# EAGLE design SEMAFORO (EAGLE 7.3.0)
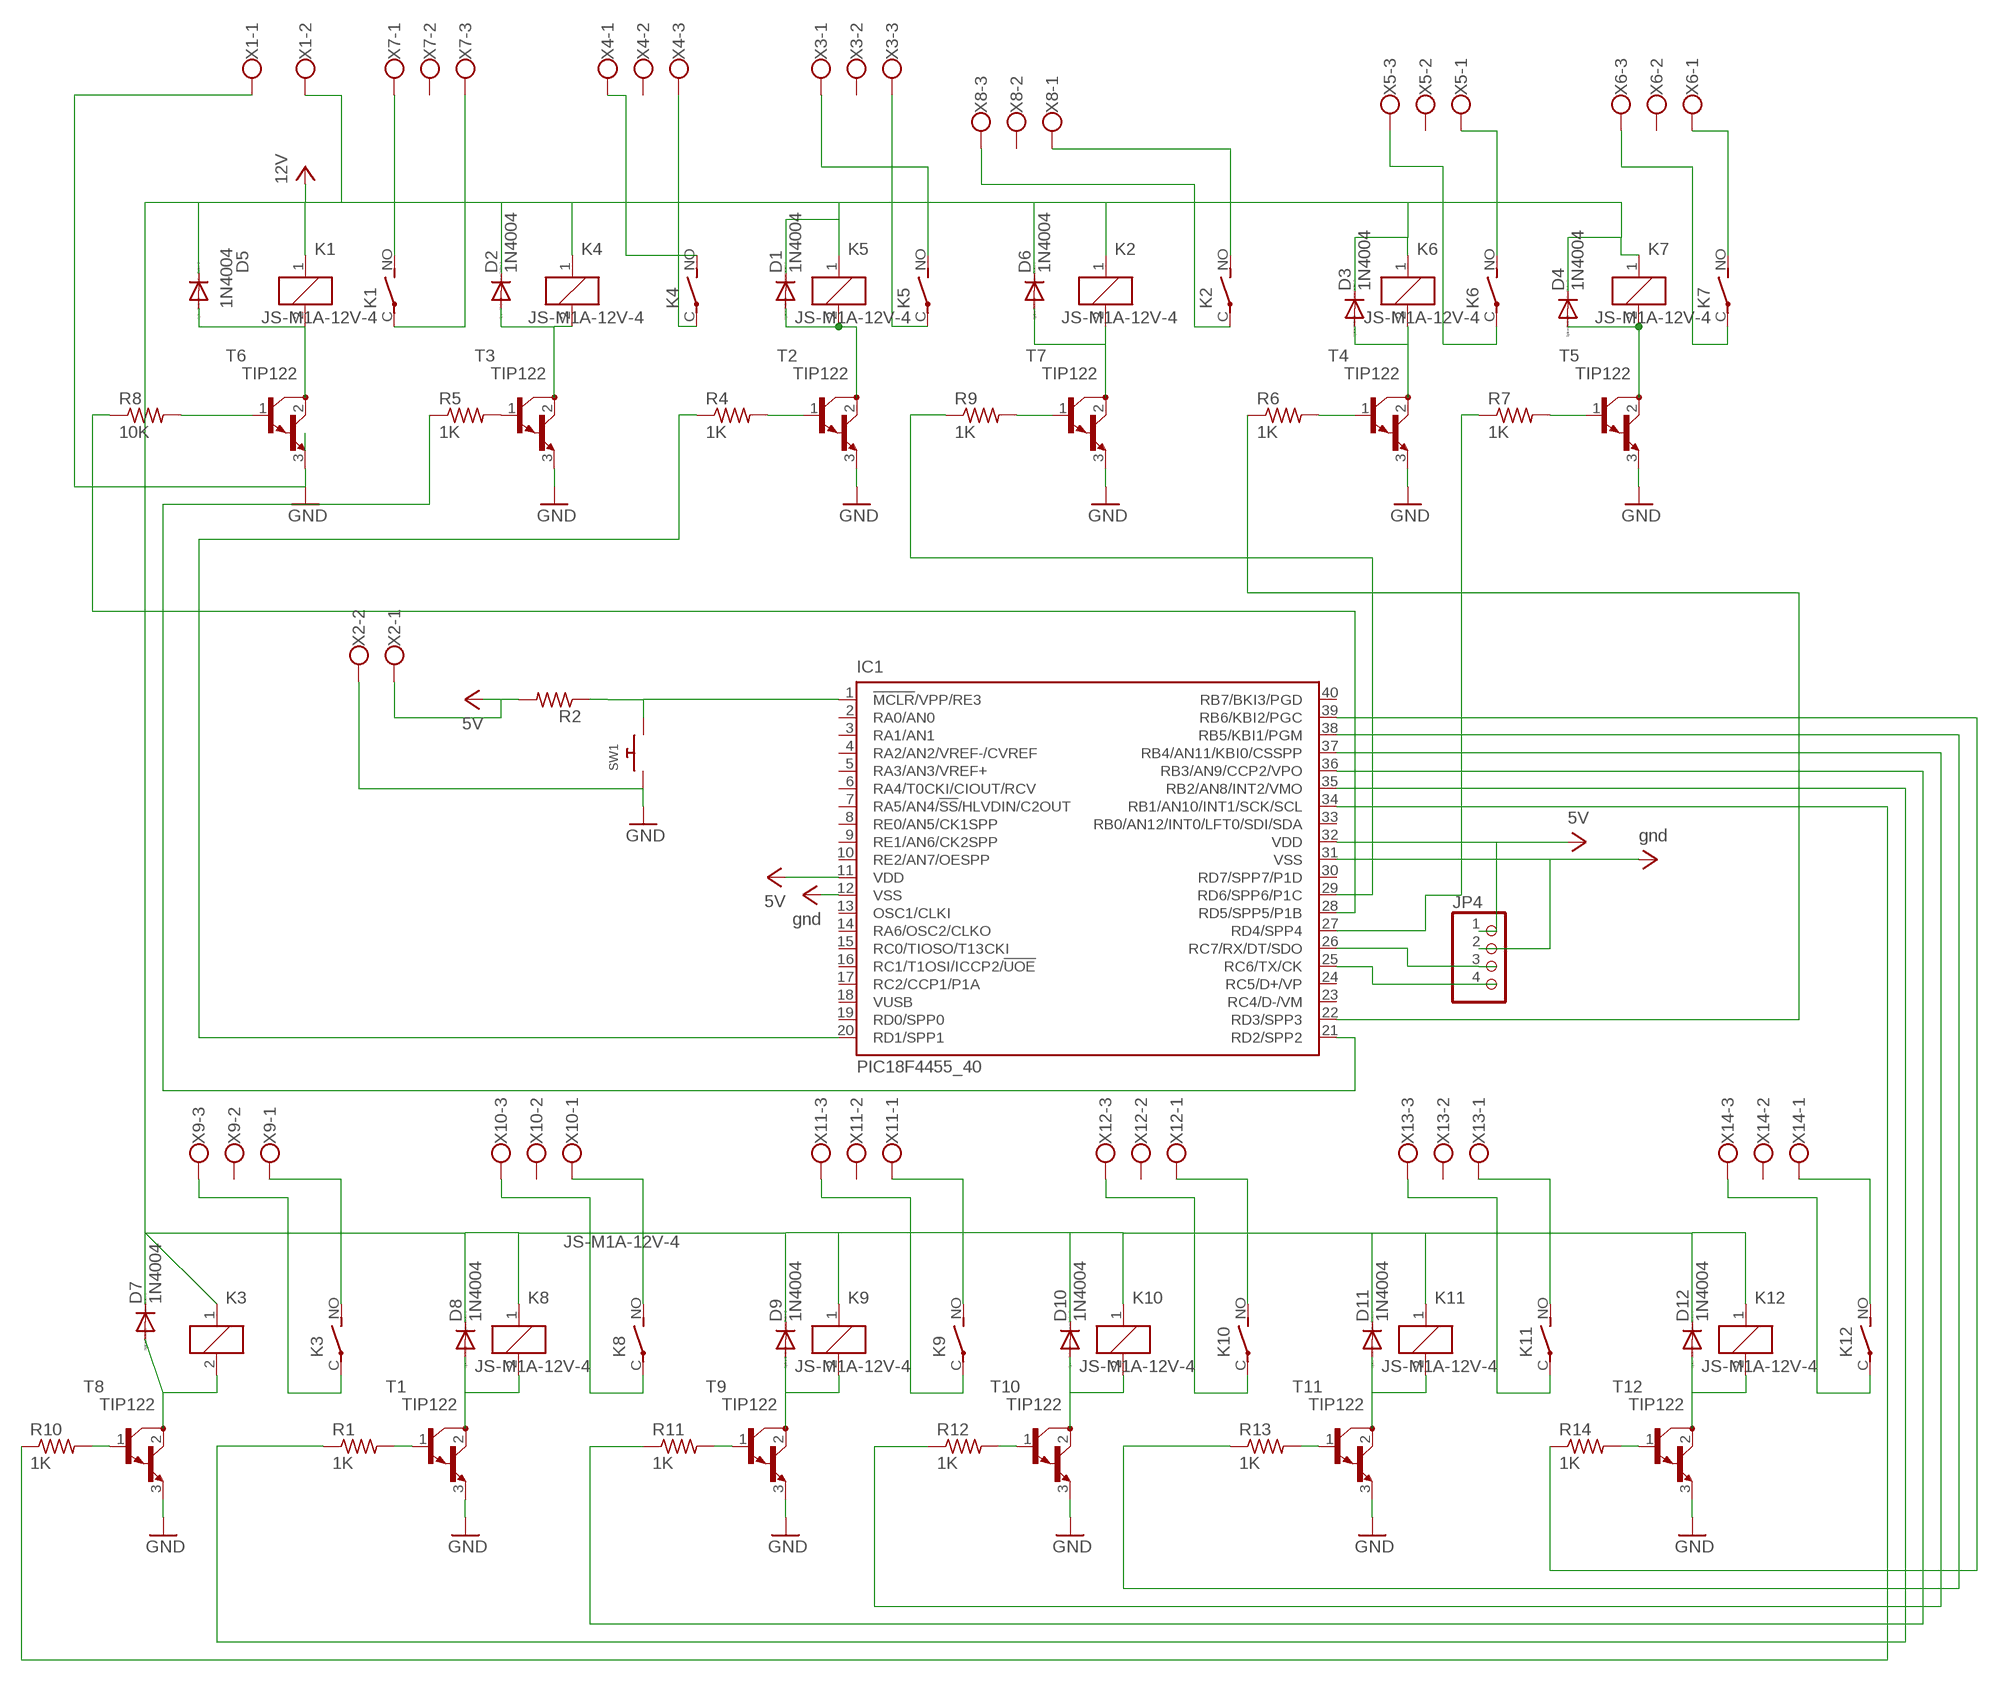
[diagram p0: schematic, sheet 1]

## Parts
D1  1N4004  [DO41-10]
D2  1N4004  [DO41-10]
D3  1N4004  [DO41-10]
D4  1N4004  [DO41-10]
D5  1N4004  [DO41-10]
D6  1N4004  [DO41-10]
D7  1N4004  [DO41-10]
D8  1N4004  [DO41-10]
D9  1N4004  [DO41-10]
D10  1N4004  [DO41-10]
D11  1N4004  [DO41-10]
D12  1N4004  [DO41-10]
IC1  PIC18F4455_40  [DIL40]
JP4  PINHD-1X4  [1X04]
K1  JS-M1A-12V-4  [JS-M1A]
K2  JS-M1A-12V-4  [JS-M1A]
K3  JS-M1A-12V-4  [JS-M1A]
K4  JS-M1A-12V-4  [JS-M1A]
K5  JS-M1A-12V-4  [JS-M1A]
K6  JS-M1A-12V-4  [JS-M1A]
K7  JS-M1A-12V-4  [JS-M1A]
K8  JS-M1A-12V-4  [JS-M1A]
K9  JS-M1A-12V-4  [JS-M1A]
K10  JS-M1A-12V-4  [JS-M1A]
K11  JS-M1A-12V-4  [JS-M1A]
K12  JS-M1A-12V-4  [JS-M1A]
R1  1K  R-US_0207/10  [0207/10]
R2  R-US_0207/10  [0207/10]
R4  1K  R-US_0207/10  [0207/10]
R5  1K  R-US_0207/10  [0207/10]
R6  1K  R-US_0207/10  [0207/10]
R7  1K  R-US_0207/10  [0207/10]
R8  10K  R-US_0207/10  [0207/10]
R9  1K  R-US_0207/10  [0207/10]
R10  1K  R-US_0207/10  [0207/10]
R11  1K  R-US_0207/10  [0207/10]
R12  1K  R-US_0207/10  [0207/10]
R13  1K  R-US_0207/10  [0207/10]
R14  1K  R-US_0207/10  [0207/10]
SW1  SWITCH_PUSHBUTTONEVQ-PE  [TACT_PANA-EVQ]
T1  TIP122  [TO220]
T2  TIP122  [TO220]
T3  TIP122  [TO220]
T4  TIP122  [TO220]
T5  TIP122  [TO220]
T6  TIP122  [TO220]
T7  TIP122  [TO220]
T8  TIP122  [TO220]
T9  TIP122  [TO220]
T10  TIP122  [TO220]
T11  TIP122  [TO220]
T12  TIP122  [TO220]
X1  W237-102  [W237-102]
X2  W237-102  [W237-102]
X3  W237-103  [W237-103]
X4  W237-103  [W237-103]
X5  W237-103  [W237-103]
X6  W237-103  [W237-103]
X7  W237-103  [W237-103]
X8  W237-103  [W237-103]
X9  W237-103  [W237-103]
X10  W237-103  [W237-103]
X11  W237-103  [W237-103]
X12  W237-103  [W237-103]
X13  W237-103  [W237-103]
X14  W237-103  [W237-103]

## Nets
GND: IC1.12(VSS) IC1.31(VSS) JP4.2 SW1.P$1 T1.3(E) T2.3(E) T3.3(E) T4.3(E) T5.3(E) T6.3(E) T7.3(E) T8.3(E) T9.3(E) T10.3(E) T11.3(E) T12.3(E) X1.1 X2.2 ; supply symbol labelled gnd
N$1: D8.A K8.2 T1.2(C)
N$3: IC1.1(!MCLR!/VPP/RE3) R2.1 SW1.P$2
N$4: R8.2 T6.1(B)
N$5: D5.A K1.2 T6.2(C)
N$6: K4.NO(2:S) X4.1
N$7: K1.NO(2:S) X7.1
N$8: R5.2 T3.1(B)
N$9: R1.2 T1.1(B)
N$10: IC1.21(RD2/SPP2) R5.1
N$11: K8.C(2:P) X10.3
N$12: R4.2 T2.1(B)
N$13: D1.A K5.2 T2.2(C)
N$14: K1.C(2:P) X7.3
N$15: K8.NO(2:S) X10.1
N$17: K6.NO(2:S) X5.1
N$22: D2.A K4.2 T3.2(C)
N$25: R9.2 T7.1(B)
N$26: D9.A K9.2 T9.2(C)
N$28: R6.2 T4.1(B)
N$30: R11.2 T9.1(B)
N$45: R7.2 T5.1(B)
N$53: IC1.35(RB2/AN8/INT2/VMO) R1.1
N$60: IC1.20(RD1/SPP1) R4.1
N$61: D6.A K2.2 T7.2(C)
N$62: K2.NO(2:S) X8.1
N$73: K9.C(2:P) X11.3
N$74: K2.C(2:P) X8.3
N$75: D3.A K6.2 T4.2(C)
N$76: K9.NO(2:S) X11.1
N$77: D4.A K7.2 T5.2(C)
N$78: D7.A K3.2 T8.2(C)
N$79: R10.2 T8.1(B)
N$81: IC1.36(RB3/AN9/CCP2/VPO) R11.1
N$82: K3.C(2:P) X9.3
N$83: K3.NO(2:S) X9.1
N$98: IC1.37(RB4/AN11/KBI0/CSSPP) R12.1
N$127: IC1.25(RC6/TX/CK) JP4.4
N$128: IC1.26(RC7/RX/DT/SDO) JP4.3
N$129: D10.A K10.2 T10.2(C)
N$130: K4.C(2:P) X4.3
N$131: K5.NO(2:S) X3.1
N$132: K5.C(2:P) X3.3
N$133: K6.C(2:P) X5.3
N$135: K7.NO(2:S) X6.1
N$136: K7.C(2:P) X6.3
N$137: R12.2 T10.1(B)
N$138: K10.C(2:P) X12.3
N$139: K10.NO(2:S) X12.1
N$140: D11.A K11.2 T11.2(C)
N$141: R13.2 T11.1(B)
N$142: K11.C(2:P) X13.3
N$143: K11.NO(2:S) X13.1
N$144: D12.A K12.2 T12.2(C)
N$145: R14.2 T12.1(B)
N$146: K12.C(2:P) X14.3
N$147: K12.NO(2:S) X14.1
N$148: IC1.27(RD4/SPP4) R7.1
N$149: IC1.22(RD3/SPP3) R6.1
N$150: IC1.28(RD5/SPP5/P1B) R8.1
N$151: IC1.29(RD6/SPP6/P1C) R9.1
N$152: IC1.38(RB5/KBI1/PGM) R13.1
N$153: IC1.34(RB1/AN10/INT1/SCK/SCL) R10.1
N$154: IC1.39(RB6/KBI2/PGC) R14.1
VCC: IC1.11(VDD) IC1.32(VDD) JP4.1 R2.2 X2.1 ; supply symbol labelled 5V
VCC12: D1.C D2.C D3.C D4.C D5.C D6.C D7.C D8.C D9.C D10.C D11.C D12.C K1.1 K2.1 K3.1 K4.1 K5.1 K6.1 K7.1 K8.1 K9.1 K10.1 K11.1 K12.1 X1.2 ; supply symbol labelled 12V
Unconnected: IC1.2(RA0/AN0) IC1.3(RA1/AN1) IC1.4(RA2/AN2/VREF-/CVREF) IC1.5(RA3/AN3/VREF+) IC1.6(RA4/T0CKI/CIOUT/RCV) IC1.7(RA5/AN4/!SS!/HLVDIN/C2OUT) IC1.8(RE0/AN5/CK1SPP) IC1.9(RE1/AN6/CK2SPP) IC1.10(RE2/AN7/OESPP) IC1.13(OSC1/CLKI) IC1.14(RA6/OSC2/CLKO) IC1.15(RC0/TIOSO/T13CKI) IC1.16(RC1/T1OSI/ICCP2/!UOE) IC1.17(RC2/CCP1/P1A) IC1.18(VUSB) IC1.19(RD0/SPP0) IC1.23(RC4/D-/VM) IC1.24(RC5/D+/VP) IC1.30(RD7/SPP7/P1D) IC1.33(RB0/AN12/INT0/LFT0/SDI/SDA) IC1.40(RB7/BKI3/PGD) X3.2 X4.2 X5.2 X6.2 X7.2 X8.2 X9.2 X10.2 X11.2 X12.2 X13.2 X14.2

## Library data of the parts
D1-D12 = diode:1N4004: DIODE general purpose rectifier, 1 A
IC1 = microchip:PIC18F4*_40: USB Microcontrollers with nanoWatt Technology High-Performance, Enhanced Flash, 28/40/44-Pin, Source: http://ww1.microchip.com/downloads/en/devicedoc/39632c.pdf; MF: MICROCHIP; MPN: PIC18F4455-I/P; OC_FARNELL: 9321314; OC_NEWARK: 05K2028
JP4 = pinhead:PINHD-1X4: PIN HEADER
K1-K12 = relay:JS-M1A*: Automotive Ultra-Miniature Power Relay NAiS Source: http://www.mew-europe.com/.. en_ds_61211_0000.pdf; MPN: JSM1A-12V-4; OC_FARNELL: unknown; OC_NEWARK: 13P4554
R1 R2 R4-R14 = adafruit:R-US_: RESISTOR, American symbol
SW1 = adafruit:SWITCH_PUSHBUTTON: Buttons SOFTTOUCHSMD_SJ - Soft touch temporary push button (Super Junk Akihabara) Compatible with SKPMANE010 [Mouser: 688-SKPMAN] C&K_KSS = Digikey: KSS221GLFS
T1-T12 = transistor:TIP122: NPN BIPOLAR DARLINGTON TRANSISTOR
X1 X2 = con-wago-500:W237-102: WAGO SCREW CLAMP; MPN: 237-102; OC_FARNELL: unknown; OC_NEWARK: 70K9898
X3-X14 = con-wago-500:W237-103: WAGO SCREW CLAMP; MPN: 237-103; OC_FARNELL: unknown; OC_NEWARK: 18M7116

## Board
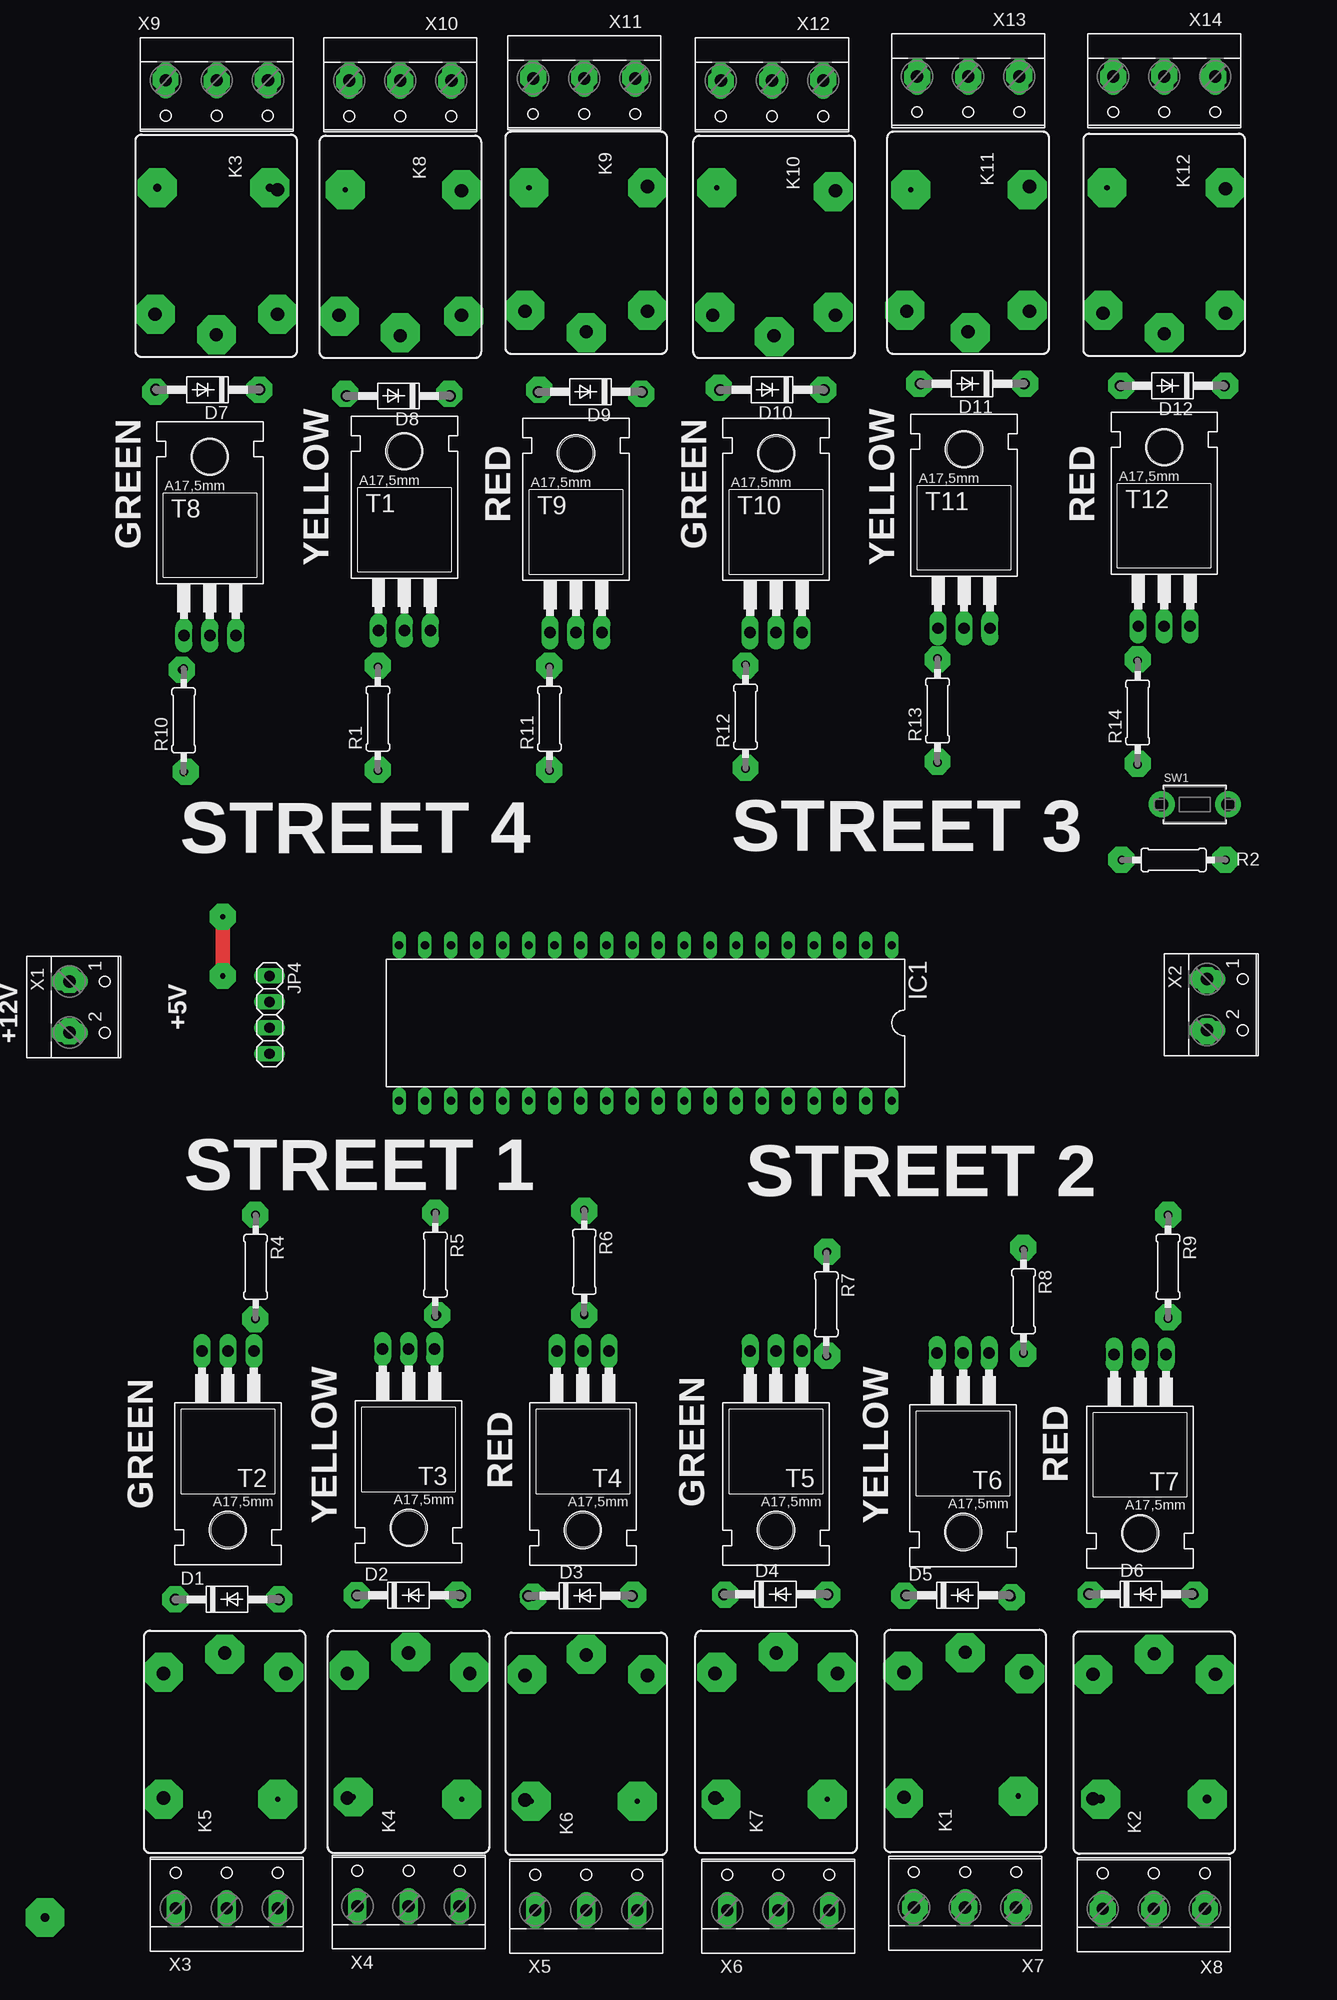
[diagram p1: board, top side]
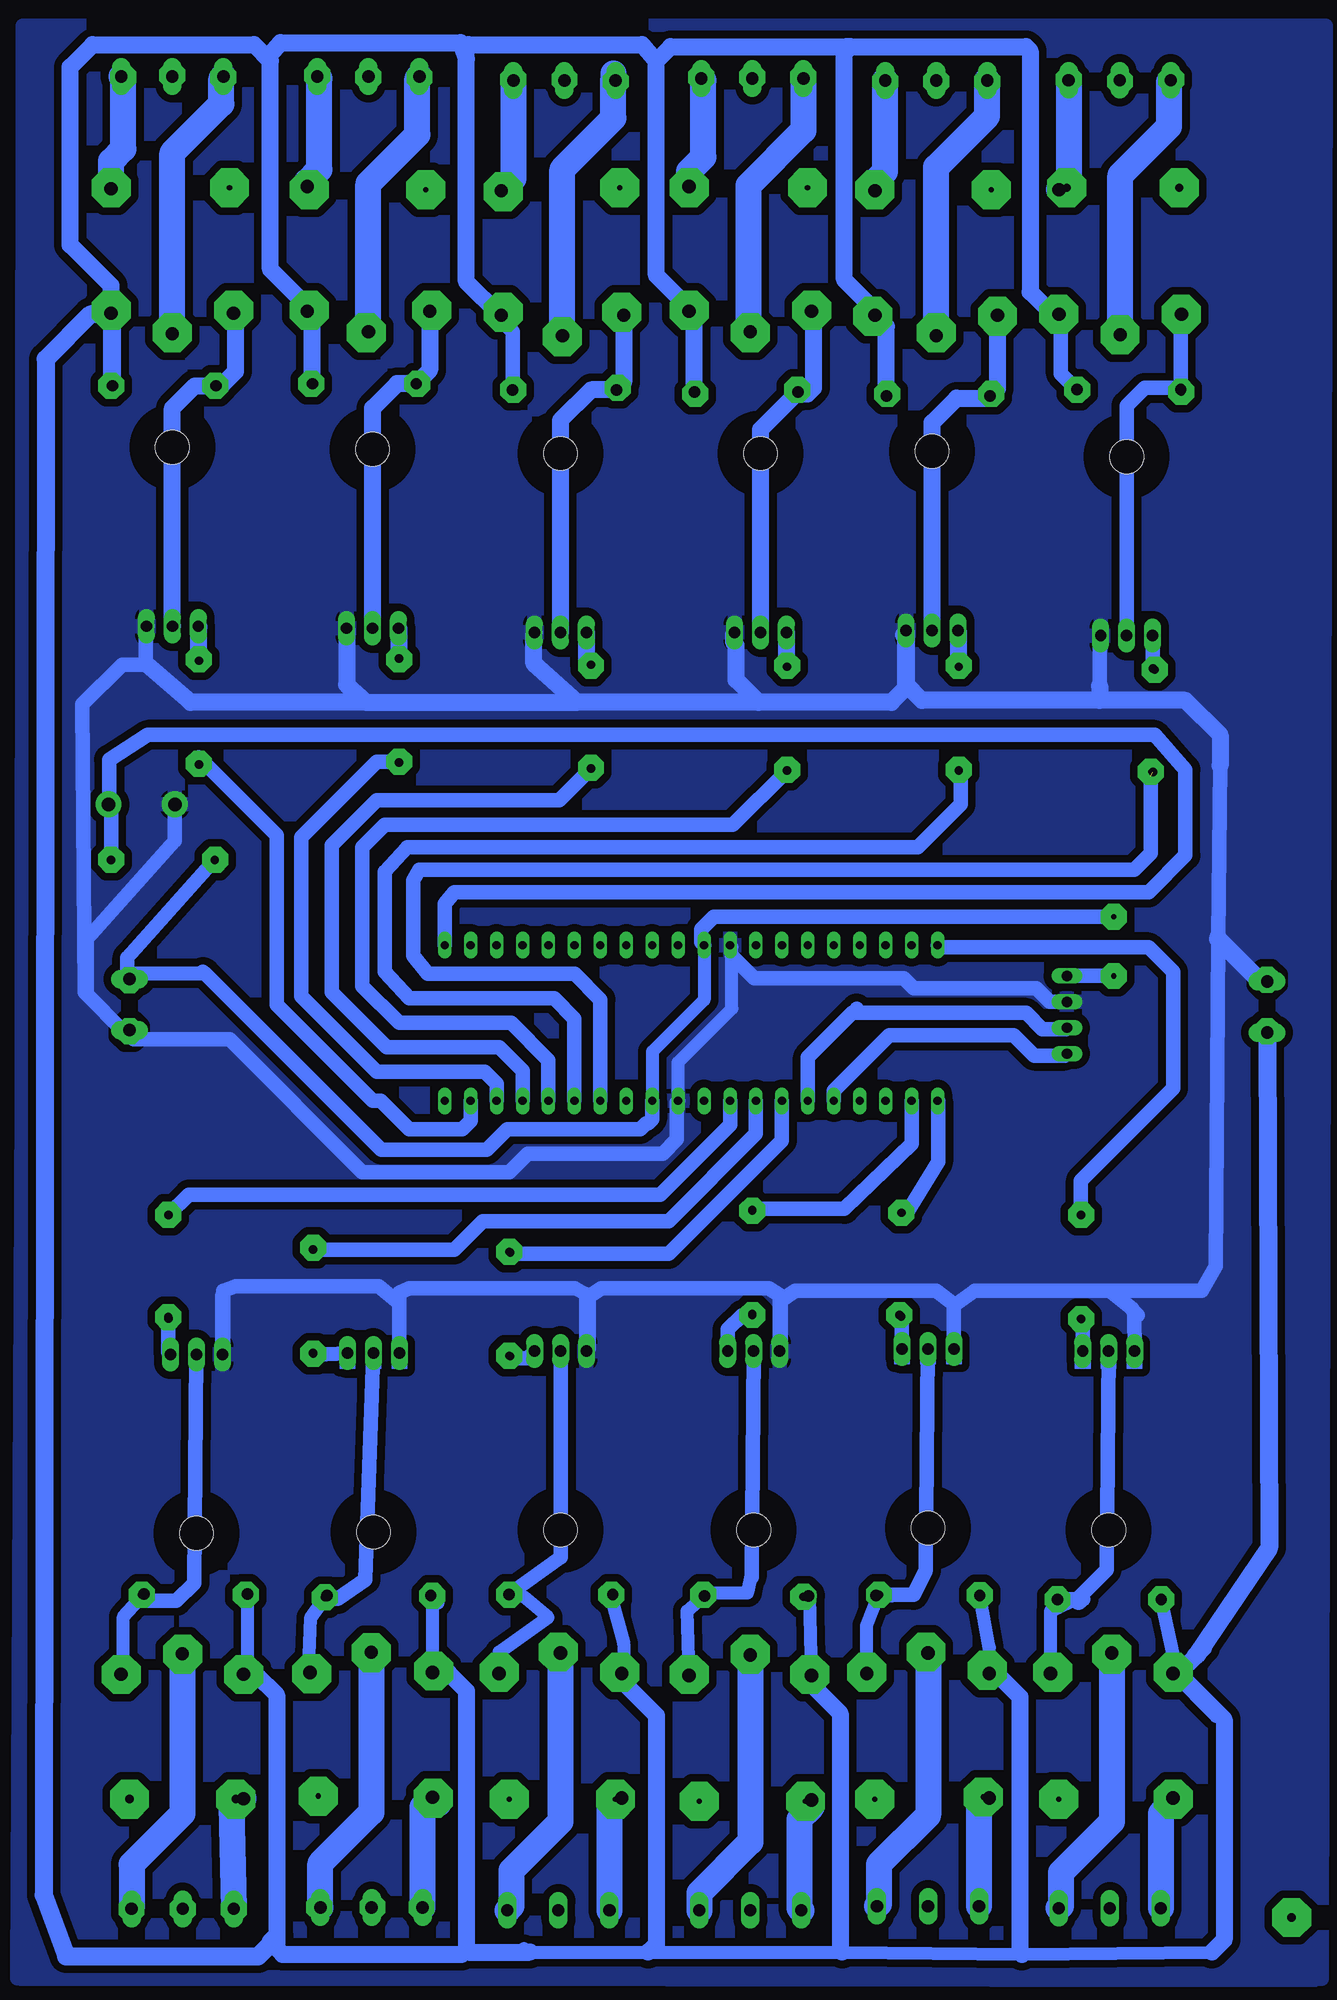
[diagram p2: board, bottom side, seen from below]

No outline drawn. Coordinates in mm, seen from the top.
Copper layers (1*16): Top 0.035mm / dielectric 1.5mm / Bottom 0.035mm
Design rules "default *": minimum track width 10mil, minimum drill 24mil, track to track 30mil, track to pad 30mil, pad to pad 30mil, via to via 30mil, smd to smd 30mil, copper to edge 40mil, drill to drill 8mil, minimum pad ring 10mil, minimum via ring 8mil, stop-mask expansion 4mil, vias tented up to drill 0mil, thermal gap 10mil

### Footprints (pad centres in the part's own frame; a part is rotated, then mirrored left to right if it is on the bottom)
DO41-10 = drill 1.118: A 5.08,0; C -5.08,0
DIL40 = drill 0.813 long: 1 -24.13,-7.62; 2 -21.59,-7.62; 3 -19.05,-7.62; 4 -16.51,-7.62; 5 -13.97,-7.62; 6 -11.43,-7.62; 7 -8.89,-7.62; 8 -6.35,-7.62; 9 -3.81,-7.62; 10 -1.27,-7.62; 11 1.27,-7.62; 12 3.81,-7.62; 13 6.35,-7.62; 14 8.89,-7.62; 15 11.43,-7.62; 16 13.97,-7.62; 17 16.51,-7.62; 18 19.05,-7.62; 19 21.59,-7.62; 20 24.13,-7.62; 21 24.13,7.62; 22 21.59,7.62; 23 19.05,7.62; 24 16.51,7.62; 25 13.97,7.62; 26 11.43,7.62; 27 8.89,7.62; 28 6.35,7.62; 29 3.81,7.62; 30 1.27,7.62; 31 -1.27,7.62; 32 -3.81,7.62; 33 -6.35,7.62; 34 -8.89,7.62; 35 -11.43,7.62; 36 -13.97,7.62; 37 -16.51,7.62; 38 -19.05,7.62; 39 -21.59,7.62; 40 -24.13,7.62
1X04 = drill 1.016 long: 1 -3.81,0; 2 -1.27,0; 3 1.27,0; 4 3.81,0
JS-M1A = drill 1.3: 1 6.7,6; 2 6.7,-6; C 8.7,0; NO -5.5,6
0207/10 = drill 0.813 pad 1.676 octagon: 1 -5.08,0; 2 5.08,0
TACT_PANA-EVQ = drill 1.3 pad 2.54: P$1 -3.25,0; P$2 3.25,0
TO220 = drill 1.118 long: 1 -2.54,-6.35; 2 0,-6.35; 3 2.54,-6.35 | hole 3.302: 0,11.176
W237-102 = drill 1.194 long: 1 -2.5,-1.27; 2 2.5,-1.27
W237-103 = drill 1.194 long: 1 -5,-1.29; 2 0,-1.29; 3 5,-1.29

### Placement (x,y rotation side)
D1  4.64,53.35 0 top
D2  22.41,53.75 0 top
D3  39.19,53.7 0 top
D4  58.35,53.84 0 top
D5  76.18,53.75 0 top
D6  94.11,53.86 0 top
D7  2.73,171.82 180 top
D8  21.4,171.2 180 top
D9  40.2,171.6 180 top
D10  58,171.8 180 top
D11  77.6,172.4 180 top
D12  97.2,172.2 180 top
IC1  45.6,109.8 180 top
JP4  8.8,110.6 270 top
K1  76.91,39.48 90 top
K2  95.43,39.33 90 top
K3  3.57,185.9 270 top
K4  22.4,39.4 90 top
K5  4.4,39.4 90 top
K6  39.8,39.2 90 top
K7  58.4,39.4 90 top
K8  21.6,185.8 270 top
K9  39.8,186.2 270 top
K10  58.2,185.8 270 top
K11  77.2,186.2 270 top
K12  96.4,186 270 top
R1  19.4,139.6 90 top
R2  97.33,125.77 180 top
R4  7.43,85.92 270 top
R5  25.03,86.14 270 top
R6  39.61,86.41 270 top
R7  63.32,82.25 270 top
R8  82.63,82.55 270 top
R9  96.78,85.93 270 top
R10  0.38,139.44 90 top
R11  36.2,139.6 90 top
R12  55.4,139.8 90 top
R13  74.2,140.4 90 top
R14  93.8,140.2 90 top
SW1  99.4,131.2 0 top
T1  22,154.6 0 top
T2  4.71,71.33 180 top
T3  22.41,71.53 180 top
T4  39.47,71.32 180 top
T5  58.38,71.32 180 top
T6  76.71,71.13 180 top
T7  94.04,71 180 top
T8  2.95,154.08 0 top
T9  38.8,154.4 0 top
T10  58.4,154.4 0 top
T11  76.8,154.8 0 top
T12  96.4,155 0 top
X1  -9.54,111.36 270 top
X2  101.86,111.6 270 top
X3  4.6,24.4 0 top
X4  22.4,24.6 0 top
X5  39.8,24.2 0 top
X6  58.6,24.2 0 top
X7  76.9,24.46 0 top
X8  95.39,24.34 0 top
X9  3.63,200.82 180 top
X10  21.6,200.8 180 top
X11  39.6,201 180 top
X12  58,200.8 180 top
X13  77.2,201.2 180 top
X14  96.4,201.2 180 top

### Tracks (layer width: path | path; a pad name or v marks a point on that pad's centre or on a via)
GND
  Bottom 1.27: IC1.31 46.87,105.93 41.6,111.2 41.6,116.4 41.6,117.23 IC1.12
  Bottom 1.422: 91.5,83.1 T7.3 91.4,77.46 91.4,83.6 90.2,84 76.2,84 74.17,82.37 T6.3 74.2,77.51 74.2,83.4 73.2,83.8 57,83.8 55.84,83.24 T5.3 55.6,77.92 55.6,83 54.4,83.8 38,83.8 36.93,83.13 T4.3 36.8,77.81 36.8,82.6 35.4,83.6 21.6,83.6 19.87,82.27 T3.3 19.87,82.13 17.8,83.6 4.6,83.6 | 5.6,142.8 5.6,147.61 T8.3 | 4.6,83.6 2.4,81.8 2.4,81.71 1.86,81.17 2.2,81.2 T2.3 2,77.31 | 4.6,83.6 -4.4,83.6 -5.8,86 -6,118 -6,118.2 -6.2,135 | 99.6,108.21 100.79,109.19 X2.2 101,109.1 101.2,109 104.8,112.6 | 99.6,108.21 96.6,108.2 | IC1.31 47,102.05 47,98.4 48.4,97 61.6,97 63.4,95.2 77.8,95.2 90.8,108.2 96.6,108.2 | SW1.P$1 96.15,127.65 104.8,118 104.8,112.6 | 99,149.2 99,148.59 99,145 | 104.8,112.6 105,112.8 105.2,141 101.31,144.89 98.87,144.89 | 96.6,108.2 100.2,108.2 99.6,108.21 | JP4.2 10.47,111.87 11.8,113.2 23.8,113.2 24.8,114.2 39.4,114.2 41.6,116.4
  Bottom 1.676: -6,118 -6,118.2 | 5.6,141.4 -2.8,141.4 -6.2,138 -6.2,135 | 5.6,141.4 23,141.4 24.6,143 24.6,147.6 24.8,147.8 | T1.3 24.54,142.66 26,141.2 39,141.2 | 39,141.2 41.2,143.4 41.2,146.8 41.4,147 41.4,147.99 T9.3 | 39,141.2 56.8,141.2 | 56.8,141.2 61,145 61,147.99 T10.3 | T11.3 79.34,142.94 77.4,141.2 | 77.4,141.2 56.8,141.2 | 77.4,141.2 94.6,141.2 98.87,144.89 99,145 | 99,148.59 T12.3 | 5.6,142.8 5.6,141.4
  Bottom 1.778: X1.1 -10.14,113.86 -6,118
  pour Bottom: 110.6,207.15 -15.98,206.18 -15.38,16.08 111.6,16.24
N$1  (via drill 0.5 pad 3.81)
  Bottom 1.676: K8.2 v15.6,179 15.6,171.92 D8.A 16.52,171 19.6,171 22,168.6 T1.2
N$2  (via drill 0.5 pad 3.81)
  other vias: 82.1,34.09
N$3
  Bottom 1.422: IC1.1 69.73,121.47 68.8,122.6 0.8,122.6 -2.8,126.2 -2.8,134.6 0.2,138 98.8,138 102.6,135.6 102.6,131.25 SW1.P$2 102.41,130.96 R2.1
N$4
  Bottom 1.422: T6.1 82.25,77.29 R8.2
N$5
  Bottom 1.27: 83.06,46.73 82.86,51.55 D5.A
  Bottom 1.422: T6.2 77.51,55.29 80.2,53.4 81.51,53.4 D5.A | 83.06,46.73 K1.2
N$6
  Bottom 2.54: X4.1 17.4,33.6 17,34 16.5,34 K4.NO
N$7
  Bottom 2.54: 70.32,33.39 K1.NO 71.9,33 X7.1
N$8
  Bottom 1.422: T3.1 24.95,80.98 R5.2
N$9
  Bottom 1.676: T1.1 19.46,144.74 R1.2
N$10
  Bottom 1.27: 21.4,102.11 IC1.21
  Bottom 1.422: 21.4,102.11 21.4,96.2 24.6,91 24.81,91 R5.1
N$11  (via drill 0.5 pad 2.54)
  Bottom 2.54: K8.C 21.6,193.6 16.6,198.6 v16.6,202 X10.3
N$12
  Bottom 1.422: T2.1 7.25,80.66 R4.2
N$13  (via drill 0.8 pad 2.54)
  Bottom 1.27: K5.2 10.4,52.2 7.58,53.58
  Bottom 1.422: D1.A 7.8,53.35 | 7.8,53.35 7.43,53.35 7.18,53.35 | T2.2 4.91,56.24 7.58,53.58 7.8,53.35
  Bottom 1.676: 7.65,53.14 7.43,53.35
  other vias: 9.72,53.35
N$14
  Bottom 2.54: K1.C 76.91,32.49 81.9,27.5 X7.3
N$15  (via drill 0.5 pad 2.54)
  Bottom 2.54: K8.NO 27.6,192.2 26.6,193.2 v26.6,202 X10.1
N$16
  pour Bottom: -16.54,207.48 -16.14,16.19 111.25,16.19 111.05,207.48
N$17
  Bottom 2.54: K6.NO 33.8,33 35,31.8 35,23.11 X5.1
N$18  (via drill 0.5 pad 3.81)
  other vias: 34.4,33.6
N$20  (via drill 0.8 pad 2.54)
  other vias: 7.4,80.8
N$21  (via drill 0.5 pad 3.81)
  other vias: 53,33.8
N$22  (via drill 0.5 pad 3.81, 0.8 pad 2.54)
  Bottom 1.27: K4.2 v28.4,46.2 28.4,50.8 v27.2,53.8
  Bottom 1.422: T3.2 22.61,56.19 23.8,53.8 v27.2,53.8 27.44,53.8 D2.A 25.95,53.75
N$23  (via drill 0.8 pad 2.54)
  other vias: 7.4,91
N$25
  Bottom 1.422: R9.2 96.78,77.55 T7.1
N$26
  Bottom 1.676: T9.2 38.8,167.92 D9.A 35.12,171.48 35.2,171.4 34.2,171.4 33.6,172 33.6,179.3 K9.2
N$27  (via drill 0.5 pad 3.81)
  other vias: 17,34
N$28
  Bottom 1.422: 39.81,81.12 R6.2 39.74,81.2 40.6,81.2 42.01,79.79 T4.1
N$29  (via drill 0.8 pad 3.81)
  other vias: 70.82,46.34
N$30
  Bottom 1.676: T9.1 36.26,144.94 36.4,144.8 36.4,144.88 R11.2
N$31  (via drill 0.8 pad 3.81)
  other vias: 70.87,33.89
N$32  (via drill 0.8 pad 3.81)
  other vias: 82.75,46.09
N$33  (via drill 0.8 pad 3.81)
  other vias: 76.91,48.12
N$34  (via drill 0.8 pad 2.54)
  other vias: -0.44,53.35
N$35  (via drill 0.8 pad 2.54)
  other vias: 17.33,53.75
N$36  (via drill 0.8 pad 2.54)
  other vias: 70.95,53.7
N$37  (via drill 0.8 pad 2.54)
  other vias: 81.46,53.55
N$38  (via drill 0.5 pad 3.81)
  other vias: 27.6,33.8
N$39  (via drill 0.5 pad 3.81)
  other vias: 9.6,33.8
N$40  (via drill 0.8 pad 2.54)
  other vias: 39.6,91.4
N$41  (via drill 0.8 pad 2.54)
  other vias: 25,91.2
N$42  (via drill 0.8 pad 2.54)
  other vias: 39.6,81.2
N$45
  Bottom 1.422: R7.2 63.12,76.98 61.62,76.98 T5.1
N$47  (via drill 0.5 pad 3.81)
  other vias: -1.6,33.8
N$48  (via drill 0.5 pad 3.81)
  other vias: 44.8,33.6
N$49  (via drill 0.8 pad 2.54)
  other vias: -10.81,114.03
N$50  (via drill 0.5 pad 3.81)
  other vias: 10.2,46.2
N$51  (via drill 0.8 pad 2.54)
  other vias: -10.81,109
N$52  (via drill 0.5 pad 3.81)
  other vias: 4.4,48
N$53
  Bottom 1.422: IC1.35 57.03,110.23 59,112.2 73.2,112.2 75.6,114.8 75.6,124.6 73.4,127 23.4,127 19.2,131.2 19.2,134.32 R1.1
N$54  (via drill 0.8 pad 2.54)
  other vias: 63.4,77.2
N$55  (via drill 0.8 pad 2.54)
  other vias: 63.4,87.4
N$56  (via drill 0.5 pad 3.81)
  other vias: 16.6,46.4
N$57  (via drill 0.5 pad 3.81)
  other vias: 22.6,48.2
N$58  (via drill 0.5 pad 3.81)
  other vias: 39.8,48
N$59  (via drill 0.5 pad 3.81)
  other vias: 34,46
N$60
  Bottom 1.422: R4.1 7.43,94.37 -1.6,103.4 -1.6,114.8 0.8,117.2 21.25,117.2 IC1.20
N$61
  Bottom 1.27: 101.19,46.27 101.19,51.66 D6.A
  Bottom 1.422: T7.2 94.24,54.96 96,53.2 99.4,53.2 99.8,53.6 99.45,53.6 D6.A | 101.19,46.27 K2.2
N$62
  Bottom 2.54: K2.NO 90.63,33.21 X8.1
N$63
  pour Bottom: 2.17,75.96 arc-90 1.41,76.72 1.41,77.99 arc-90 2.17,78.75 arc-90 2.93,77.99 2.93,76.72 arc-90
N$64
  pour Bottom: 4.71,75.96 arc-90 3.95,76.72 3.95,77.99 arc-90 4.71,78.75 arc-90 5.47,77.99 5.47,76.72 arc-90
N$65
  pour Bottom: 7.25,75.96 arc-90 6.49,76.72 6.49,77.99 arc-90 7.25,78.75 arc-90 8.01,77.99 8.01,76.72 arc-90
N$66
  pour Bottom: 19.87,76.36 arc-90 19.11,77.12 19.11,78.39 arc-90 19.87,79.15 arc-90 20.63,78.39 20.63,77.12 arc-90
N$67
  pour Bottom: 22.41,76.36 arc-90 21.65,77.12 21.65,78.39 arc-90 22.41,79.15 arc-90 23.17,78.39 23.17,77.12 arc-90
N$68
  pour Bottom: 24.95,76.36 arc-90 24.19,77.12 24.19,78.39 arc-90 24.95,79.15 arc-90 25.71,78.39 25.71,77.12 arc-90
N$69
  pour Bottom: 74.17,75.96 arc-90 73.41,76.72 73.41,77.99 arc-90 74.17,78.75 arc-90 74.93,77.99 74.93,76.72 arc-90
N$70
  pour Bottom: 76.71,75.96 arc-90 75.95,76.72 75.95,77.99 arc-90 76.71,78.75 arc-90 77.47,77.99 77.47,76.72 arc-90
N$71
  pour Bottom: 79.25,75.96 arc-90 78.49,76.72 78.49,77.99 arc-90 79.25,78.75 arc-90 80.01,77.99 80.01,76.72 arc-90
N$72  (via drill 0.5 pad 3.81)
  other vias: 52.6,46.2
N$73
  Bottom 2.54: X11.3 34.6,197.2 40,191.8 40,177.8 40.1,177.7 | 40.1,177.7 40.4,177.4 | K9.C 39.9,177.5 40.1,177.7
N$74
  Bottom 2.54: K2.C 95.43,32.37 100.4,27.4 X8.3
N$75  (via drill 0.5 pad 3.81)
  Bottom 1.27: 43.97,54 40.08,54 39.67,55.8 | K6.2 v45.8,46 46,52.23 D3.A
  Bottom 1.422: T4.2 39.67,55.8 39.67,55.53 | 43.97,54 D3.A
N$76
  Bottom 2.54: K9.NO 45.8,193.2 44.4,194.6 44.4,202.09 X11.1
N$77  (via drill 0.5 pad 3.81)
  Bottom 1.27: K7.2 v64.4,46.2 64.4,48.2 59.6,51.6 61.99,53.6 D4.A
  Bottom 1.422: T5.2 58.38,57.49 D4.A
N$78
  Bottom 1.422: T8.2 2.95,170.25 1.2,172 -2.17,172 D7.A -2.35,179.15 -2.8,179.6 -2.8,179.57 K3.2
N$79
  Bottom 1.422: T8.1 0.41,144.55 R10.2
N$80  (via drill 0.5 pad 3.81)
  other vias: 58.6,48.2
N$81
  Bottom 1.422: IC1.36 59.57,106.17 63.2,109.8 74.2,109.8 77.8,113.4 77.8,127 75.6,129.2 41.52,129.2 R11.1
N$82
  Bottom 2.54: K3.C 3.57,192.83 -1.2,197.6 -1.2,201.95 X9.3
N$83
  Bottom 2.54: X9.1 8.63,192.34 K3.NO
N$84  (via drill 0.5 pad 3.81)
  other vias: 63.4,33.8
N$85  (via drill 0.8 pad 3.81)
  other vias: 90.2,33.8
N$86  (via drill 0.8 pad 3.81)
  other vias: 101.4,46
N$87  (via drill 0.8 pad 3.81)
  other vias: 95.4,48
N$88  (via drill 0.8 pad 3.81)
  other vias: 89.4,46
N$89  (via drill 0.8 pad 3.81)
  other vias: 9.6,179.2
N$90  (via drill 0.8 pad 3.81)
  other vias: 3.6,177.2
N$91  (via drill 0.8 pad 3.81)
  other vias: -2.4,179.2
N$92  (via drill 0.8 pad 3.81)
  other vias: -2.2,191.6
N$93  (via drill 0.8 pad 3.81)
  other vias: 8.8,191.6
N$94  (via drill 0.8 pad 3.81)
  other vias: 100.6,33.8
N$95  (via drill 0.8 pad 2.54)
  other vias: 82.6,77.4
N$96  (via drill 0.8 pad 2.54)
  other vias: 96.8,81
N$97  (via drill 0.8 pad 2.54)
  other vias: 96.8,91
N$98
  Bottom 1.422: IC1.37 62.11,105.11 64.4,107.4 75.4,107.4 80.8,112.8 80.8,127.2 76.4,131.6 58.52,131.6 R12.1
N$99  (via drill 0.8 pad 2.54)
  other vias: 0.2,144.4
N$100  (via drill 0.8 pad 2.54)
  other vias: 53.4,53.8
N$101  (via drill 0.8 pad 2.54)
  other vias: 63.4,53.8
N$102  (via drill 0.8 pad 2.54)
  other vias: 89.2,53.8
N$103  (via drill 0.8 pad 2.54)
  other vias: 99.4,53.8
N$104  (via drill 0.8 pad 2.54)
  other vias: 7.8,171.8
N$105  (via drill 0.8 pad 2.54)
  other vias: -2.4,171.6
N$106  (via drill 0.8 pad 2.54)
  other vias: 44.4,53.8
N$107  (via drill 0.8 pad 2.54)
  other vias: 34.6,53.6
N$108  (via drill 0.8 pad 2.54)
  other vias: 25.2,81.2
N$109  (via drill 0.8 pad 3.81)
  other vias: -13.2,22.2
N$111  (via drill 0.5 pad 3.81)
  other vias: 16.2,191.4
N$112  (via drill 0.5 pad 3.81)
  other vias: 27.6,191.4
N$113  (via drill 0.5 pad 3.81)
  other vias: 21.6,177.4
N$114  (via drill 0.5 pad 2.54)
  other vias: 72,23.2
N$115  (via drill 0.5 pad 2.54)
  other vias: 76.8,23.2
N$116  (via drill 0.5 pad 2.54)
  other vias: 82,23.2
N$117  (via drill 0.5 pad 2.54)
  other vias: 90.4,23
N$118  (via drill 0.5 pad 2.54)
  other vias: 95.4,23
N$119  (via drill 0.5 pad 2.54)
  other vias: 100.4,23
N$120  (via drill 0.5 pad 2.54)
  other vias: 8.6,202.2
N$121  (via drill 0.5 pad 2.54)
  other vias: 3.6,202
N$122  (via drill 0.5 pad 2.54)
  other vias: -1.4,202.2
N$123  (via drill 0.5 pad 3.81)
  other vias: 27.8,179
N$124  (via drill 0.5 pad 3.81)
  other vias: 33.8,179.6
N$125  (via drill 0.5 pad 3.81)
  other vias: 39.8,177.4
N$126  (via drill 0.5 pad 3.81)
  other vias: 45.8,179.6
N$127
  Bottom 1.422: IC1.25 31.63,103.17 26.2,108.6 14,108.6 12,106.6 8.99,106.6 JP4.4
N$128
  Bottom 1.422: IC1.26 34.17,106.43 30.1,110.5 29.8,110.8 | 29.8,110.8 29.4,111.2 | JP4.3 8.93,109.2 11.2,109.2 12.8,110.8 29.8,110.8
N$129
  Bottom 1.676: K10.2 52.2,172.52 D10.A 55.4,171.8 58.4,168.8 T10.2
N$130
  Bottom 2.54: K4.C 22.4,32.2 27.2,27.4 27.2,23.51 X4.3
N$131
  Bottom 2.54: K5.NO -1.6,33.6 -0.4,32.4 X3.1
N$132
  Bottom 2.54: K5.C 4.4,31.6 9.4,26.6 9.4,23.31 X3.3
N$133
  Bottom 2.54: K6.C 39.8,29.6 44.8,24.6 X5.3
N$134  (via drill 0.5 pad 3.81)
  other vias: 45.8,191.6
N$135
  Bottom 2.54: K7.NO 53.1,33.9 53.6,33.4 X6.1
N$136
  Bottom 2.54: 58.4,48.2 K7.C 58.4,31.6 63.2,26.8 63.2,23.31 X6.3
N$137
  Bottom 1.676: T10.1 55.86,144.94 R12.2
N$138
  Bottom 2.54: K10.C 58.2,193.4 53.2,198.4 53.2,202.29 | 53.2,202.8 53.2,202.29 | 53.2,202.29 X12.3
N$139
  Bottom 2.54: X12.1 63,192.5 K10.NO
N$140
  Bottom 1.676: K11.2 71.2,173.72 D11.A 74.4,172.4 76.8,170 T11.2
N$141
  Bottom 1.676: R13.2 74.2,148.39 T11.1
N$142
  Bottom 2.54: K11.C 77.2,192 72.4,196.8 72.4,202.29 X13.3
N$143
  Bottom 2.54: K11.NO 83.2,192.2 82,193.4 82,202.29 X13.1
N$144  (via drill 0.5 pad 2.54)
  Bottom 1.676: T12.2 96.4,170 94.2,172.2 v92.2,172.2 D12.A 91.6,172.2 90.2,173.6 90.2,179.1 K12.2
N$145  (via drill 0.5 pad 2.54)
  Bottom 1.676: R14.2 v93.8,145.4 93.8,148.59 T12.1
N$146  (via drill 0.5 pad 3.81)
  Bottom 2.54: K12.C v96.4,177.4 96.4,195 91.6,199.8 91.6,202.29 X14.3
N$147
  Bottom 2.54: K12.NO 102.4,194.2 101.2,195.4 101.2,202.29 X14.1
N$148
  Bottom 1.422: IC1.27 36.71,98.29 47.8,87.2 63.19,87.2 R7.1
N$149
  Bottom 1.422: IC1.22 24.01,97.99 30.6,91.6 40,91.6 40.2,91.4 39.7,91.4 R6.1
N$150
  Bottom 1.422: IC1.28 39.25,98.95 47.8,90.4 66,90.4 68.8,87.6 82.6,87.6 R8.1
N$151
  Bottom 1.422: IC1.29 41.79,99.81 48.6,93 94.79,93 R9.1
N$152
  Bottom 1.422: IC1.38 64.65,103.85 65.8,105 76.4,105 83.8,112.4 83.8,128 76.4,135.4 74.28,135.4 R13.1
N$153  (1 unrouted)
  Bottom 1.422: IC1.34 54.49,112.09 57,114.6 71.4,114.6 72.8,116.4 72.8,123.8 72.2,124.8 2.2,124.8 0.6,126.4 0.6,133.94
N$154
  Bottom 1.422: IC1.39 67.19,100.21 68,99.4 73.2,99.4 76,102.2 76.8,102.2 86.2,111.6 86.2,128.2 93.8,135.8 R14.1
N$159  (via drill 0.5 pad 3.81)
  other vias: 34.2,191.6
N$160  (via drill 0.5 pad 3.81)
  other vias: 52.6,191.6
N$161  (via drill 0.5 pad 3.81)
  other vias: 64,191.2
N$162  (via drill 0.5 pad 3.81)
  other vias: 71.6,191.4
N$163  (via drill 0.5 pad 3.81)
  other vias: 83,191.4
N$164  (via drill 0.5 pad 3.81)
  other vias: 90.8,191.6
N$165  (via drill 0.5 pad 3.81)
  other vias: 102.4,191.6
N$166  (via drill 0.5 pad 3.81)
  other vias: 52.4,179.4
N$167  (via drill 0.5 pad 3.81)
  other vias: 64,179.4
N$168  (via drill 0.5 pad 3.81)
  other vias: 58.2,177
N$169  (via drill 0.5 pad 3.81)
  other vias: 71,179.6
N$170  (via drill 0.5 pad 3.81)
  other vias: 77.4,177.4
N$171  (via drill 0.5 pad 3.81)
  other vias: 83,179.6
N$172  (via drill 0.5 pad 3.81)
  other vias: 90.4,179.6
N$178  (via drill 0.5 pad 2.54)
  other vias: 92.2,125.8
N$179  (via drill 0.5 pad 2.54)
  other vias: 82.6,87.8
N$180  (via drill 0.5 pad 2.54)
  other vias: 102.4,125.8
N$181  (via drill 0.5 pad 2.54)
  other vias: 93.8,135.2
N$182  (via drill 0.5 pad 2.54)
  other vias: 74.2,135.4
N$183  (via drill 0.5 pad 2.54)
  other vias: 55.4,134.8
N$184  (via drill 0.5 pad 2.54)
  other vias: 36.2,134.6
N$185  (via drill 0.5 pad 2.54)
  other vias: 19.4,134.6
N$186  (via drill 0.5 pad 2.54)
  other vias: 0.6,134.4
N$187  (via drill 0.5 pad 2.54)
  other vias: 19.4,144.8
N$188  (via drill 0.5 pad 2.54)
  other vias: 36.2,144.8
N$189  (via drill 0.5 pad 2.54)
  other vias: 55.4,144.8
N$190  (via drill 0.5 pad 2.54)
  other vias: 74.2,145.4
N$191  (via drill 0.5 pad 2.54)
  other vias: 102.4,172.2
N$192  (via drill 0.5 pad 2.54)
  other vias: 82.8,172.4
N$193  (via drill 0.5 pad 2.54)
  other vias: 72.4,172.4
N$194  (via drill 0.5 pad 2.54)
  other vias: 63,171.8
N$195  (via drill 0.5 pad 2.54)
  other vias: 52.8,172
N$196  (via drill 0.5 pad 2.54)
  other vias: 45.2,171.4
N$197  (via drill 0.5 pad 2.54)
  other vias: 35.2,171.8
N$198  (via drill 0.5 pad 2.54)
  other vias: 26.4,171.4
N$199  (via drill 0.5 pad 2.54)
  other vias: 16.2,171.4
N$200  (via drill 0.5 pad 2.54)
  other vias: 21.6,202
N$201  (via drill 0.5 pad 2.54)
  other vias: 34.6,202.4
N$202  (via drill 0.5 pad 2.54)
  other vias: 39.6,202.4
N$203  (via drill 0.5 pad 2.54)
  other vias: 44.6,202.4
N$204  (via drill 0.5 pad 2.54)
  other vias: 53,202
N$205  (via drill 0.5 pad 2.54)
  other vias: 58,202.2
N$206  (via drill 0.5 pad 2.54)
  other vias: 63,202.2
N$207  (via drill 0.5 pad 2.54)
  other vias: 72.2,202.4
N$208  (via drill 0.5 pad 2.54)
  other vias: 77.2,202.4
N$209  (via drill 0.5 pad 2.54)
  other vias: 82.2,202.6
N$210  (via drill 0.5 pad 2.54)
  other vias: 91.4,202.4
N$211  (via drill 0.5 pad 2.54)
  other vias: 96.4,202.6
N$212  (via drill 0.5 pad 2.54)
  other vias: 101.2,202.4
N$213  (via drill 0.5 pad 2.54)
  other vias: 100.6,114
N$214  (via drill 0.5 pad 2.54)
  other vias: 100.6,109
VCC  (via drill 0.5 pad 2.54)
  Top 1.422: v4.2,114.4 v4.2,120.2
  Bottom 1.27: IC1.11 44.33,112.07 49.4,107 IC1.32
  Bottom 1.422: IC1.32 49.41,100.39 49.8,100 50,100 50.6,99.4 63.6,99.4 65.6,97.4 75.92,97.4 93.21,114.69 | 93.4,114.8 93.21,114.69 | 93.21,114.69 100.6,114.6 101.2,114 100.7,114 X2.1 100.7,114.1 100.8,114.2 100.8,116.21 R2.2 | JP4.1 4.41,114.41 4.2,114.2 v4.2,114.4 | v4.2,120.2 43.4,120.2 44.6,119 44.6,117.69 IC1.11
VCC12  (via drill 0.5 pad 3.81)
  Bottom 1.27: K1.1 70.91,53.31 70.4,53 71,53.65 D5.C | K2.1 89.03,46.26 D6.C | D4.C 53.47,53.67 52.2,49 52.2,46.6 | 52.2,46.6 52.2,46.5 K7.1 | 52.2,46.6 52.8,46.6 | 61.99,19.15 61.94,18.8 61.8,18.8 | 61.4,18.8 49.8,18.8 30.8,18.8 13.2,18.6 -5.4,18.8 | K4.1 16.4,48.62 D2.C | K6.1 34,53.59 D3.C | D1.C -1.6,47.99 v-1.6,46.2 K5.1 -5.8,41.9
  Bottom 1.422: -0.6,53.51 D1.C | D7.C 9.4,173.4 9.4,178.8 | D4.C 52.96,54.04 | D10.C 63.08,177.48 64.2,178.6 K10.1
  Bottom 1.676: D1.C -0.19,53.35 | 69.8,46.59 70.82,45.58 70.82,46.09 K1.1 69.38,46.18 67.6,44.4 67.6,19.4 67.52,19.16 | 52.8,46.6 52.8,45.8 49,42 49,19.6 49.8,18.8 | 67.52,19.16 67.4,18.8 61.8,18.8 61.4,18.8 | K4.1 15.7,46.1 13.4,43.8 13.4,19.2 13.2,18.6 | K6.1 33.8,45 31,42.2 31,19 30.8,18.8 | K2.1 88.23,46.03 86.2,44 86.2,20.4 86.2,19.2 85.6,18.6 68.08,18.6 67.52,19.16 | K5.1 -2.1,46.1 | -2.1,46.1 -6.6,41.6 -6.6,20 -5.4,18.8 | -4.6,48.6 -3.8,47.8 -2.1,46.1 | D8.C 26.48,177.98 K8.1 27.6,179.6 30.6,182.6 30.6,204.8 30.2,205.2 | D9.C 45.28,178.98 | 45.28,178.98 K9.1 | D11.C 82.68,178.98 K11.1 83.2,180 86.8,183.6 86.8,204 | 30.2,205.2 30,205.4 12.8,205.4 12.4,205 12.4,181.4 9.8,178.8 9.4,178.8 9.4,179.03 K3.1 | 45.28,178.98 45.28,179.28 49,183 49,204 | 49,204 47.6,205.4 30.4,205.4 30.2,205.2 | K10.1 64.3,179.1 67.6,182.4 67.6,204.2 | 67.6,204.2 67.6,205.2 67.4,205.6 50.4,205.6 49,204 | 86.8,204 86.8,204.6 85.8,205.8 68.2,205.8 67.6,204.2 | K12.1 v102.4,179.6 102.4,182 106.4,186 106.4,203.4 104.2,205.6 88.4,205.6 86.8,204
  Bottom 1.778: 102.28,179.18 104.42,179.18 108.8,174.8 109,24.4 106.8,18.4 88,18.4 86.8,19.6 86.8,19.8 86.2,20.4 | D12.C 102.28,179.18 | 102.28,179.18 K12.1 | X1.2 -11.01,58.41 -3.8,47.8
(copper drawn outside any net)
  shapes: Bottom area x9

### Text on the board
tNames: RED | RED | GREEN | GREEN | YELLOW | YELLOW | STREET 3 | STREET 4 | +5V | +12V | STREET 1 | STREET 2 | RED | RED | GREEN | GREEN | YELLOW | YELLOW